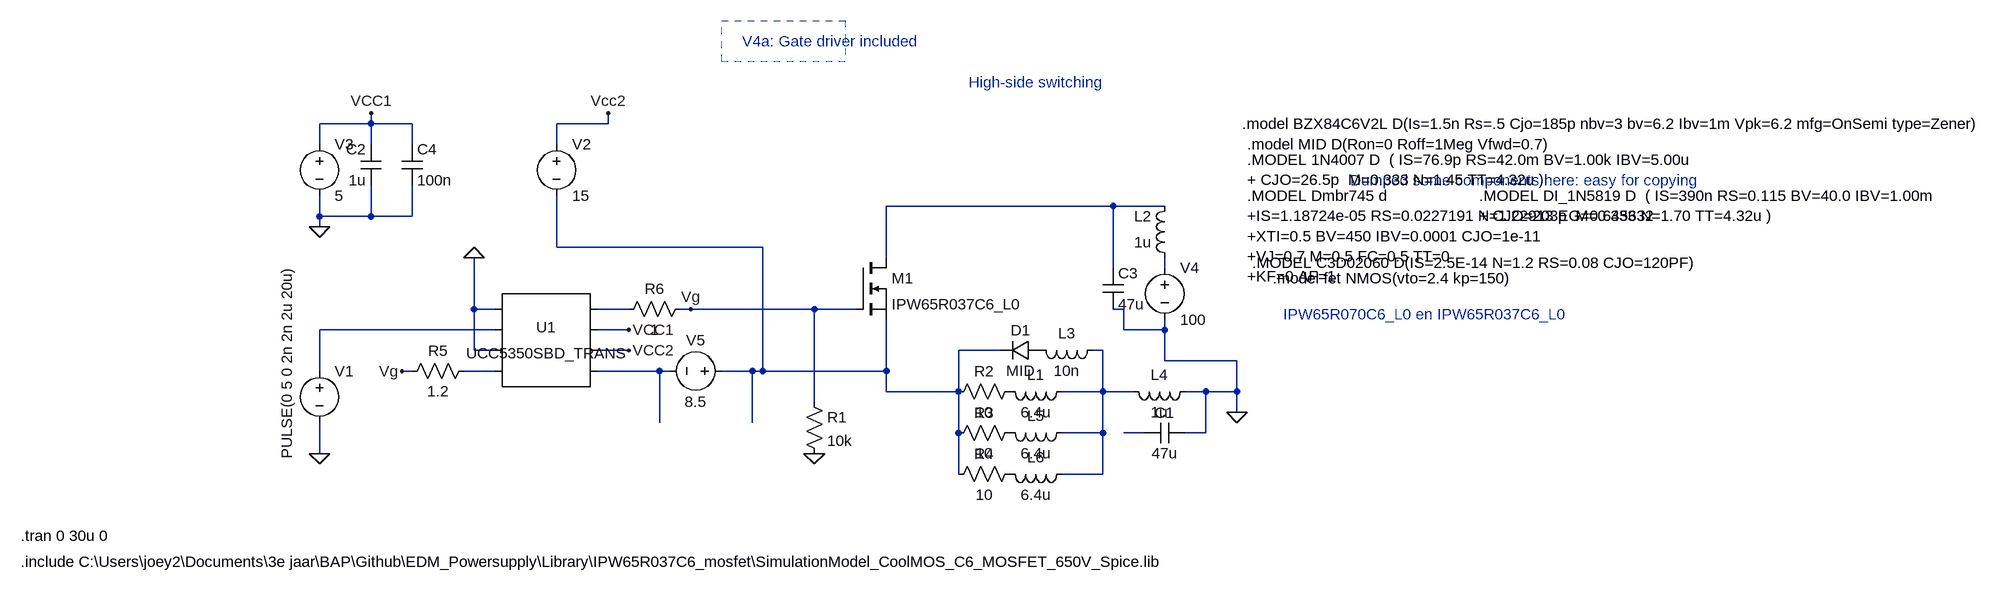
[diagram p0: schematic EDM_Powersupply_V4a_HSS.asc]
* EDM_Powersupply_V4a_HSS.asc
* U1: UCC5350SBD_TRANS (symbol AutoGenerated\UCC5350SBD_TRANS not available, pins judged from their places): pin1=0 pin2=N005 pin3=0 pin4=N007 pin5=N004 pin6=VCC1 pin7=VCC2 pin8=N008
V1 N005 0 PULSE(0 5 0 2n 2n 2u 20u)
V2 VCC2 N002 15
C2 0 VCC1 1u
V3 VCC1 0 5
R5 N007 Vg 1.2
R6 Vg N004 1
V5 N002 N008 8.5
C4 VCC1 0 100n
R2 N002 P001 10
V4 N003 0 100
XM1 N001 Vg N002 IPW65R037C6_L0  ; pins D G S
L1 N006 P001 6.4u
R1 Vg 0 10k
D1 P002 N002 MID
C3 N001 0 47u
L2 N003 N001 1u
L3 N006 P002 10n
L4 0 N006 1u
R3 N002 P003 10
L5 N006 P003 6.4u
R4 N002 P004 10
L6 N006 P004 6.4u
C1 0 N009 47u
.model D D
.lib standard.dio
.include C:\Users\joey2\Documents\3e jaar\BAP\Github\EDM_Powersupply\Library\IPW65R037C6_mosfet\SimulationModel_CoolMOS_C6_MOSFET_650V_Spice.lib
.tran 0 30u 0
* High-side switching
* Dumped some components here: easy for copying
.model BZX84C6V2L D(Is=1.5n Rs=.5 Cjo=185p nbv=3 bv=6.2 Ibv=1m Vpk=6.2 mfg=OnSemi type=Zener)
.model MID D(Ron=0 Roff=1Meg Vfwd=0.7)
* V4a: Gate driver included
.MODEL 1N4007 D  ( IS=76.9p RS=42.0m BV=1.00k IBV=5.00u
+ CJO=26.5p  M=0.333 N=1.45 TT=4.32u )
.MODEL Dmbr745 d
+IS=1.18724e-05 RS=0.0227191 N=1.22913 EG=0.645632
+XTI=0.5 BV=450 IBV=0.0001 CJO=1e-11
+VJ=0.7 M=0.5 FC=0.5 TT=0
+KF=0 AF=1
.MODEL DI_1N5819 D  ( IS=390n RS=0.115 BV=40.0 IBV=1.00m
+ CJO=203p  M=0.333 N=1.70 TT=4.32u )
.model fet NMOS(vto=2.4 kp=150)
* IPW65R070C6_L0 en IPW65R037C6_L0
.MODEL C3D02060 D(IS=2.5E-14 N=1.2 RS=0.08 CJO=120PF)
.backanno
.end

* Results of the author's LTspice run, read from the files saved beside the schematic
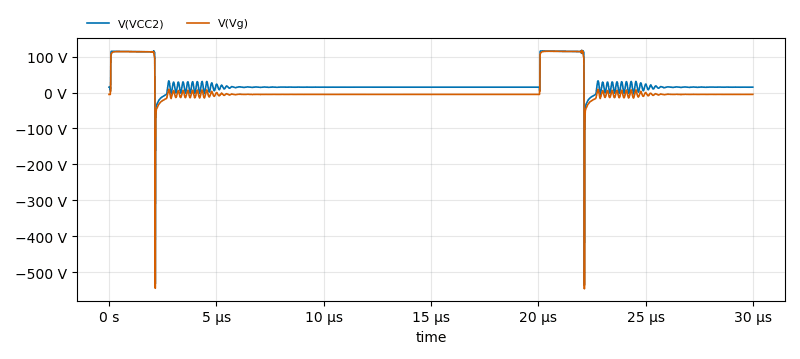
[diagram p1: Transient Analysis of EDM_Powersupply_V4a_HSS.asc, plotted from the saved traces]
* Transient Analysis, 1 run:
*   V(VCC2): min -536 V, max 117.4 V, average 26.74 V, rms 47.3 V, last 15.07 V
*   V(Vg): min -546.2 V, max 117.3 V, average 9.793 V, rms 45.51 V, last -5.091 V